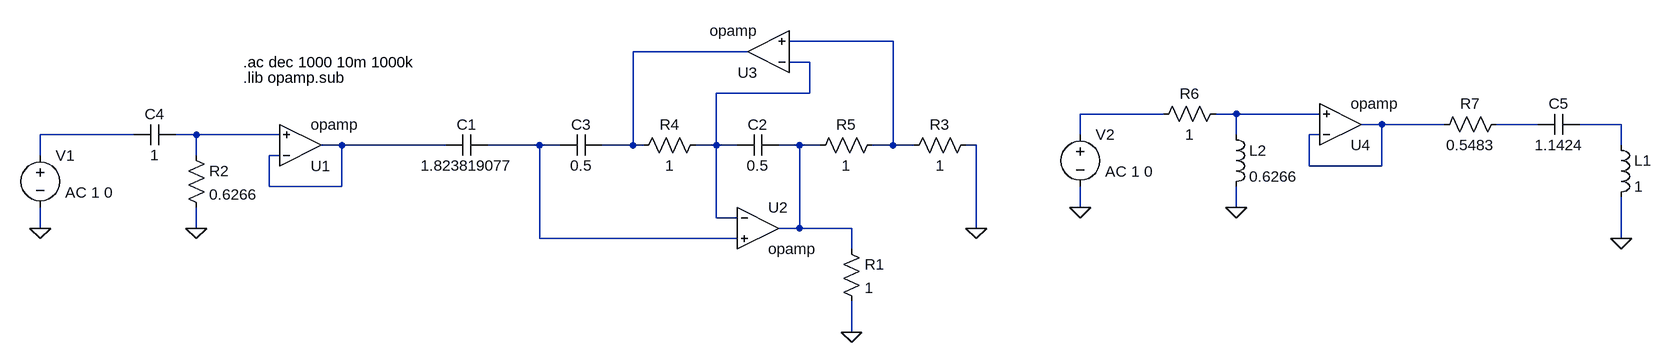
[diagram p0: schematic CircTarea4HP.asc]
CircTarea4HP.asc, the LTspice schematic file:
Version 4.1
SHEET 1 1368 1384
WIRE 144 -80 -16 -80
WIRE -80 -64 -256 -64
WIRE 16 -48 -16 -48
WIRE 16 0 16 -48
WIRE 16 0 -128 0
WIRE 560 32 432 32
WIRE 672 32 640 32
WIRE 800 32 672 32
WIRE 896 48 864 48
WIRE 992 48 896 48
WIRE 1136 48 1072 48
WIRE 1264 48 1200 48
WIRE -1024 64 -1168 64
WIRE -928 64 -960 64
WIRE -800 64 -928 64
WIRE 432 64 432 32
WIRE 672 64 672 32
WIRE 800 64 784 64
WIRE -704 80 -736 80
WIRE -544 80 -704 80
WIRE -400 80 -480 80
WIRE -368 80 -400 80
WIRE -256 80 -256 -64
WIRE -256 80 -304 80
WIRE -240 80 -256 80
WIRE -128 80 -128 0
WIRE -128 80 -160 80
WIRE -96 80 -128 80
WIRE 0 80 -32 80
WIRE 32 80 0 80
WIRE 144 80 144 -80
WIRE 144 80 112 80
WIRE 176 80 144 80
WIRE 272 80 256 80
WIRE 1264 80 1264 48
WIRE -1168 96 -1168 64
WIRE -928 96 -928 64
WIRE -800 96 -816 96
WIRE 784 112 784 64
WIRE 896 112 896 48
WIRE 896 112 784 112
WIRE -816 144 -816 96
WIRE -704 144 -704 80
WIRE -704 144 -816 144
WIRE 432 176 432 144
WIRE 672 176 672 144
WIRE -128 192 -128 80
WIRE -96 192 -128 192
WIRE -1168 208 -1168 176
WIRE -928 208 -928 176
WIRE 0 208 0 80
WIRE 0 208 -32 208
WIRE 80 208 0 208
WIRE 272 208 272 80
WIRE -400 224 -400 80
WIRE -96 224 -400 224
WIRE 1264 224 1264 160
WIRE 80 240 80 208
WIRE 80 368 80 320
FLAG 80 368 0
FLAG -928 208 0
FLAG -1168 208 0
FLAG 672 176 0
FLAG 432 176 0
FLAG 1264 224 0
FLAG 272 208 0
SYMBOL voltage -1168 80 R0
WINDOW 123 38 73 Left 2
WINDOW 39 0 0 Left 0
SYMATTR Value2 AC 1 0
SYMATTR InstName V1
SYMATTR Value ""
SYMBOL OpAmps\\opamp -768 144 M180
SYMATTR InstName U1
SYMBOL res 272 64 R90
WINDOW 0 0 56 VBottom 2
WINDOW 3 32 56 VTop 2
SYMATTR InstName R3
SYMATTR Value 1
SYMBOL res -144 64 R90
WINDOW 0 0 56 VBottom 2
WINDOW 3 32 56 VTop 2
SYMATTR InstName R4
SYMATTR Value 1
SYMBOL cap -32 64 R90
WINDOW 0 0 32 VBottom 2
WINDOW 3 32 32 VTop 2
SYMATTR InstName C2
SYMATTR Value 0.5
SYMBOL res 128 64 R90
WINDOW 0 0 56 VBottom 2
WINDOW 3 32 56 VTop 2
SYMATTR InstName R5
SYMATTR Value 1
SYMBOL cap -304 64 R90
WINDOW 0 0 32 VBottom 2
WINDOW 3 32 32 VTop 2
SYMATTR InstName C3
SYMATTR Value 0.5
SYMBOL OpAmps\\opamp -64 144 R0
SYMATTR InstName U2
SYMBOL OpAmps\\opamp -48 0 R180
SYMATTR InstName U3
SYMBOL cap -480 64 R90
WINDOW 0 0 32 VBottom 2
WINDOW 3 32 32 VTop 2
SYMATTR InstName C1
SYMATTR Value 1.823819077
SYMBOL res 64 224 R0
SYMATTR InstName R1
SYMATTR Value 1
SYMBOL res -944 80 R0
SYMATTR InstName R2
SYMATTR Value 0.6266
SYMBOL cap -960 48 R90
WINDOW 0 0 32 VBottom 2
WINDOW 3 32 32 VTop 2
SYMATTR InstName C4
SYMATTR Value 1
SYMBOL voltage 432 48 R0
WINDOW 123 38 73 Left 2
WINDOW 39 0 0 Left 0
SYMATTR Value2 AC 1 0
SYMATTR InstName V2
SYMATTR Value ""
SYMBOL OpAmps\\opamp 832 112 M180
SYMATTR InstName U4
SYMBOL res 656 16 R90
WINDOW 0 0 56 VBottom 2
WINDOW 3 32 56 VTop 2
SYMATTR InstName R6
SYMATTR Value 1
SYMBOL res 976 64 R270
WINDOW 0 32 56 VTop 2
WINDOW 3 0 56 VBottom 2
SYMATTR InstName R7
SYMATTR Value 0.5483
SYMBOL cap 1200 32 R90
WINDOW 0 0 32 VBottom 2
WINDOW 3 32 32 VTop 2
SYMATTR InstName C5
SYMATTR Value 1.1424
SYMBOL ind 1248 64 R0
SYMATTR InstName L1
SYMATTR Value 1
SYMBOL ind 656 48 R0
SYMATTR InstName L2
SYMATTR Value 0.6266
TEXT -856 -48 Left 2 !.ac dec 1000 10m 1000k
TEXT -856 -24 Left 2 !.lib opamp.sub

The netlist it stands for:
* CircTarea4HP.asc
V1 N009 0 AC 1 0
X§U1 N011 N010 N011 opamp Aol=100K GBW=10Meg  ; pins invin noninvin out
R3 0 N001 1
R4 N003 N002 1
C2 N013 N003 0.5
R5 N001 N013 1
C3 N002 N012 0.5
X§U2 N003 N012 N013 opamp Aol=100K GBW=10Meg  ; pins invin noninvin out
X§U3 N003 N001 N002 opamp Aol=100K GBW=10Meg  ; pins invin noninvin out
C1 N012 N011 1.823819077
R1 N013 0 1
R2 N010 0 0.6266
C4 N010 N009 1
V2 N004 0 AC 1 0
X§U4 N006 N005 N006 opamp Aol=100K GBW=10Meg  ; pins invin noninvin out
R6 N005 N004 1
R7 N006 N007 0.5483
C5 N008 N007 1.1424
L1 N008 0 1
L2 N005 0 0.6266
.ac dec 1000 10m 1000k
.lib opamp.sub
.backanno
.end